# EAGLE design 2nd project (EAGLE 9.6.2)
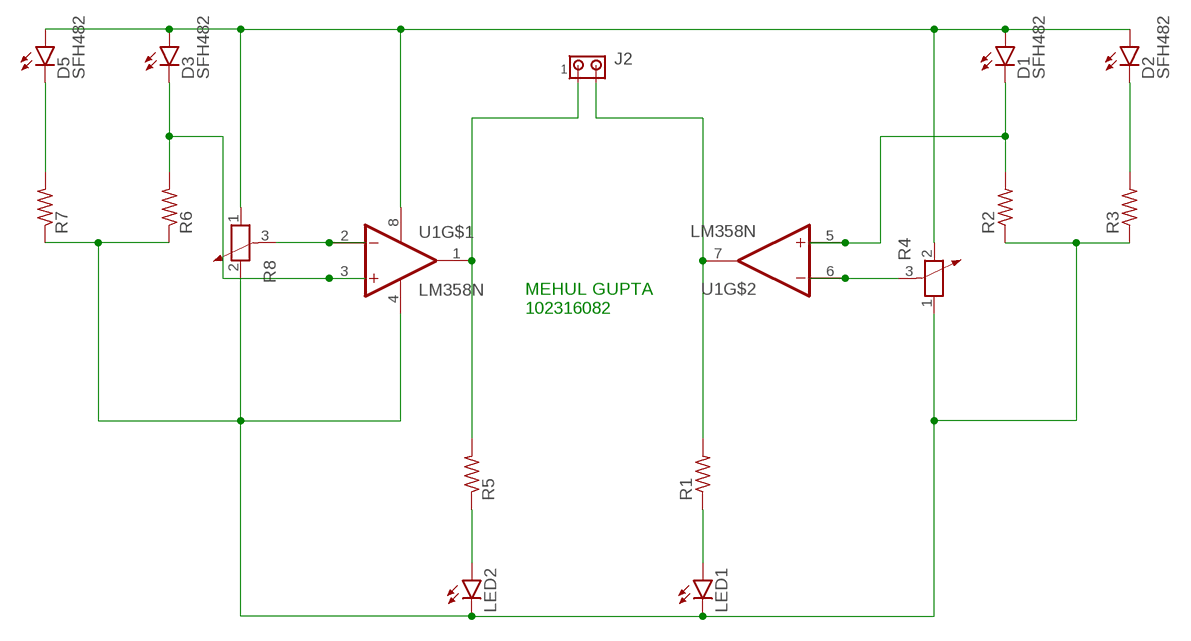
[diagram p0: schematic, sheet 1]

## Parts
D1  SFH482  [SFH482]
D2  SFH482  [SFH482]
D3  SFH482  [SFH482]
D5  SFH482  [SFH482]
J2  MTA02-100  [10X02MTA]
LED1  LED3MM  [LED3MM]
LED2  LED3MM  [LED3MM]
R1  R-US_0204/5  [0204/5]
R2  R-US_0204/5  [0204/5]
R3  R-US_0204/5  [0204/5]
R4  POTENTIOMETER_PT-10  [PT-10]
R5  R-US_0204/5  [0204/5]
R6  R-US_0204/5  [0204/5]
R7  R-US_0204/5  [0204/5]
R8  POTENTIOMETER_PT-10  [PT-10]
U1  LM358N  [DIP762W46P254L960H508Q8]

## Nets
N$1: R4.3 U1.6(2IN-)
N$2: J2.2 R1.2 U1.7(2OUT)
N$3: D3.K(C) R6.2 U1.3(1IN+)
N$4: LED1.A R1.1
N$6: D2.K(C) R3.2
N$7: D1.K(C) R2.2 U1.5(2IN+)
N$8: R8.3 U1.2(1IN-)
N$10: J2.1 R5.2 U1.1(1OUT)
N$11: LED2.A R5.1
N$12: LED1.K(C) LED2.K(C) R2.1 R3.1 R4.1 R6.1 R7.1 R8.2 U1.4(GND)
N$13: D1.A D2.A D3.A D5.A R4.2 R8.1 U1.8(VCC)
N$14: D5.K(C) R7.2

## Notes on the sheet
- MEHUL GUPTA
  102316082

## Library data of the parts
D1-D3 D5 = led:SFH482: IR LED infrared emitting diode, Infineon
J2 = con-amp:MTA02-100: AMP connector
LED1 LED2 = led:LED: LED OSRAM: - CHIPLED LG R971, LG N971, LY N971, LG Q971, LY Q971, LO R971, LY R971 LH N974, LH R974 LS Q976, LO Q976, LY Q976 LO Q996 - Hyper CHIPLED LW Q18S LB Q993, LB Q99A, LB R99A - SideLED LS A670, LO A670, LY A670, LG A670, LP A670 LB A673, LV A673, LT A673, LW A673 LH A674 LY A675 LS A676, LA A676, LO A676, LY A676, LW A676 LS A679, LY A679, LG A679 - Hyper Micro SIDELED® LS Y876, LA Y876, LO Y876, LY Y876 LT Y87S - SmartLED LW L88C, LW L88S LB L89C, LB L89S, LG L890 LS L89K, LO L89K, LY L89K LS L896, LA L896, LO L896, LY L896 - TOPLED LS T670, LO T670, LY T670, LG T670, LP T670 LSG T670, LSP T670, LSY T670, LOP T670, LYG T670 LG T671, LOG T671, LSG T671 LB T673, LV T673, LT T673, LW T673 LH T674 LS T676, LA T676, LO T676, LY T676, LB T676, LH T676, LSB T676, LW T676 LB T67C, LV T67C, LT T67C, LS T67K, LO T67K, LY T67K, LW E67C LS E67B, LA E67B, LO E67B, LY E67B, LB E67C, LV E67C, LT E67C LW T67C LS T679, LY T679, LG T679 LS T770, LO T770, LY T770, LG T770, LP T770 LB T773, LV T773, LT T773, LW T773 LH T774 LS E675, LA E675, LY E675, LS T675 LS T776, LA T776, LO T776, LY T776, LB T776 LHGB T686 LT T68C, LB T68C - Hyper Mini TOPLED® LB M676 - Mini TOPLED Santana® LG M470 LS M47K, LO M47K, LY M47K Source: http://www.osram.convergy.de LUXEON: - LUMILED® LXK2-PW12-R00, LXK2-PW12-S00, LXK2-PW14-U00, LXK2-PW14-V00 LXK2-PM12-R00, LXK2-PM12-S00, LXK2-PM14-U00 LXK2-PE12-Q00, LXK2-PE12-R00, LXK2-PE12-S00, LXK2-PE14-T00, LXK2-PE14-U00 LXK2-PB12-K00, LXK2-PB12-L00, LXK2-PB12-M00, LXK2-PB14-N00, LXK2-PB14-P00, LXK2-PB14-Q00 LXK2-PR12-L00, LXK2-PR12-M00, LXK2-PR14-Q00, LXK2-PR14-R00 LXK2-PD12-Q00, LXK2-PD12-R00, LXK2-PD12-S00 LXK2-PH12-R00, LXK2-PH12-S00 LXK2-PL12-P00, LXK2-PL12-Q00, LXK2-PL12-R00 Source: www.luxeon.com KINGBRIGHT: KA-3528ASYC Source: www.kingbright.com
R1-R3 R5-R7 = rcl:R-US_: RESISTOR, American symbol; SPICEPREFIX: R
R4 R8 = rcl:POTENTIOMETER_: Potentiometer; SPICEMODEL: POT; SPICEPREFIX: X
U1 = LM358N:LM358N: IC OPAMP GP 2 CIRCUIT 8DIP Check availability <https://pricing.snapeda.com/parts/LM358N/Harris%20Corporation/view-part?ref=eda>; AVAILABILITY: Not in stock; CHECK_PRICES: https://www.snapeda.com/parts/LM358N/Harris/view-part/?ref=eda; DESCRIPTION: General Purpose Amplifier 2 Circuit 8-PDIP; MF: Harris Corporation; MP: LM358N; PACKAGE: None; PRICE: None; SNAPEDA_LINK: https://www.snapeda.com/parts/LM358N/Harris/view-part/?ref=snap

## Board
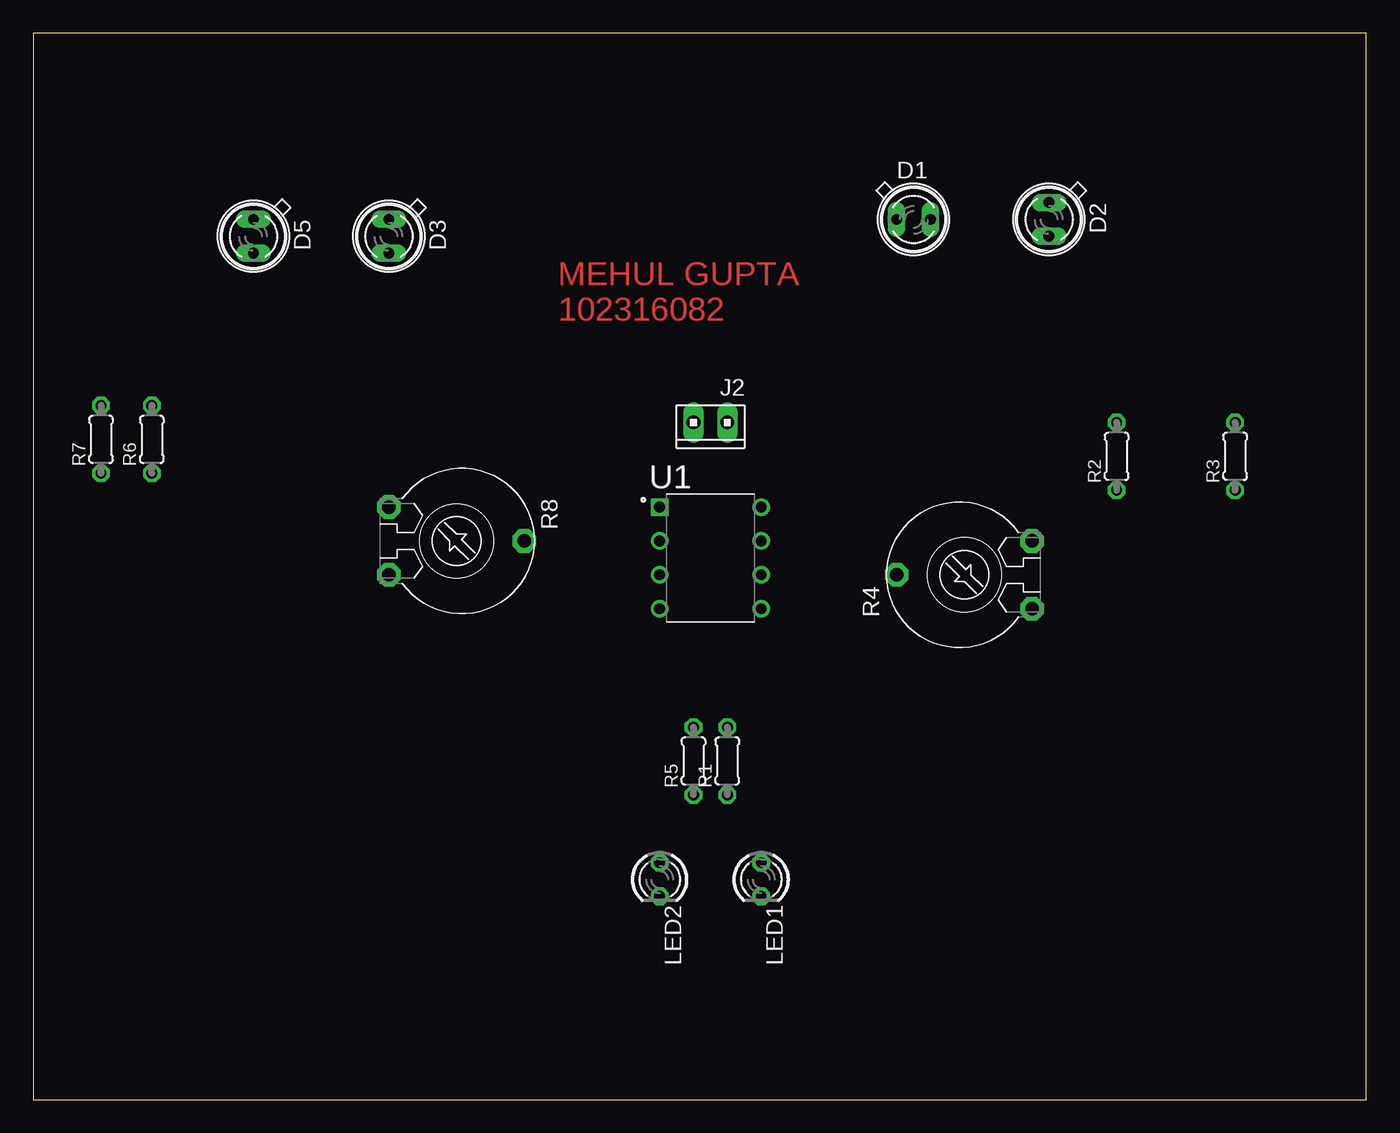
[diagram p1: board, top side]
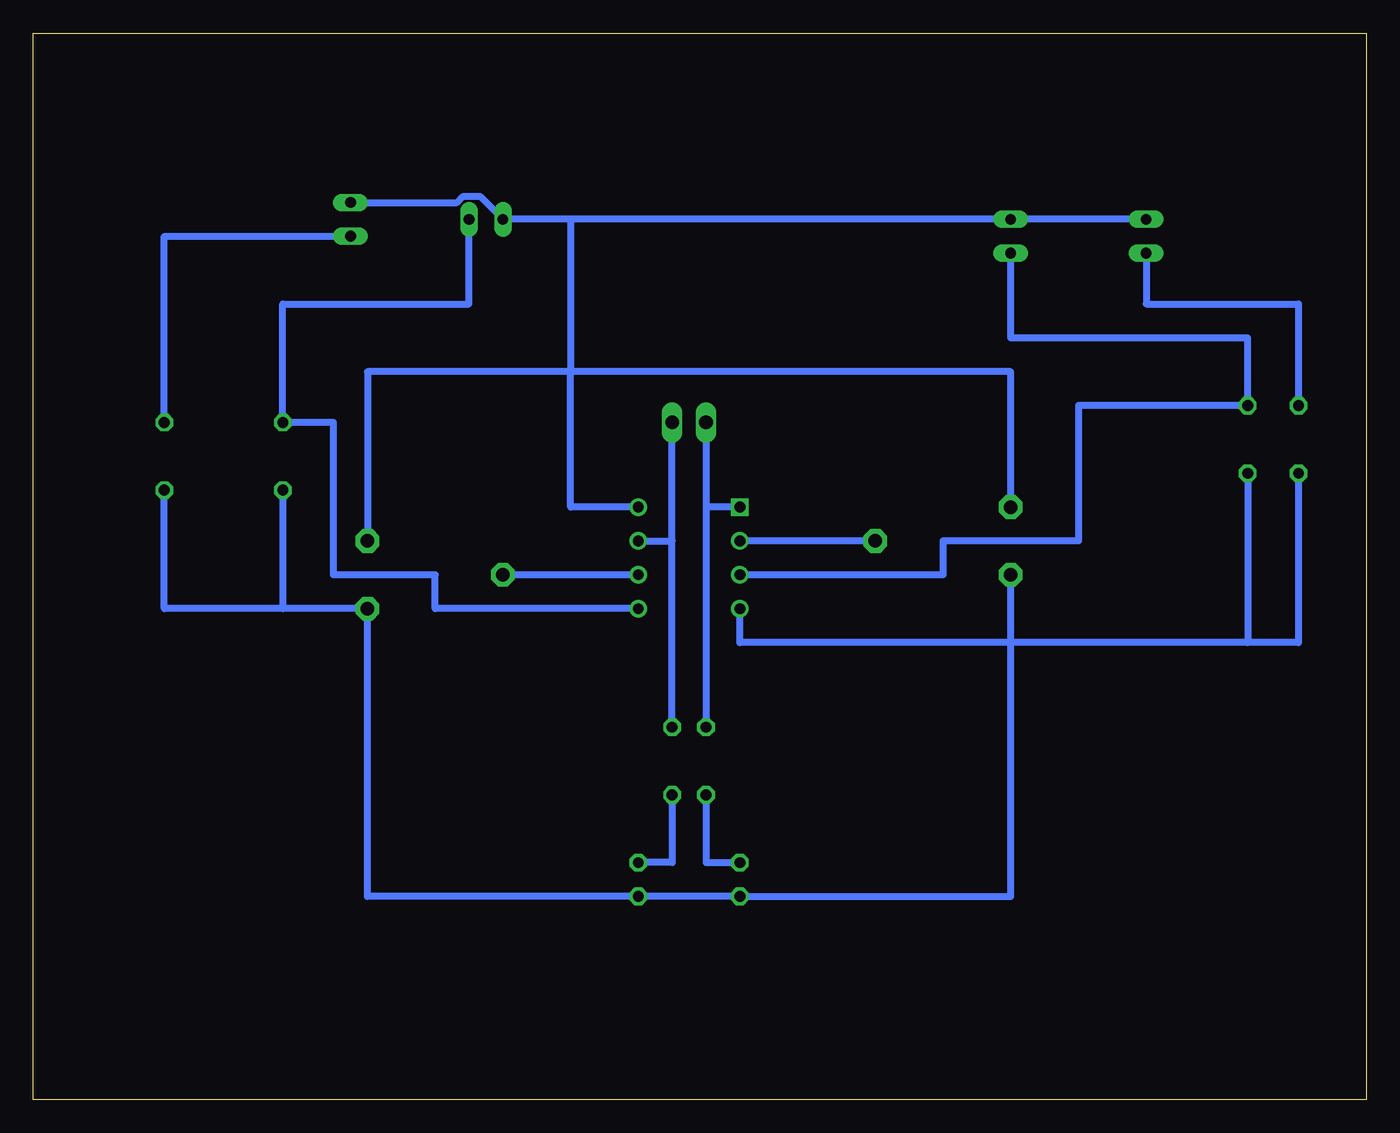
[diagram p2: board, bottom side, seen from below]

Size 100 x 80 mm. Coordinates in mm from the lower left corner, seen from the top.
Outline: 0,0 100,0 100,80 0,80 0,0
Copper layers (1*16): Top 0.035mm / dielectric 1.5mm / Bottom 0.035mm
Design rules "default": minimum track width 6mil, minimum drill 0.35mm, track to track 6mil, track to pad 6mil, pad to pad 6mil, via to via 6mil, smd to smd 6mil, copper to edge 40mil, drill to drill 6mil, minimum pad ring 10mil, minimum via ring 8mil, stop-mask expansion 4mil, vias tented up to drill 0mil, thermal gap 10mil

### Footprints (pad centres in the part's own frame; a part is rotated, then mirrored left to right if it is on the bottom)
SFH482 = drill 0.813 long: A -1.27,0; K 1.27,0
10X02MTA = drill 1.016 long: 1 1.27,0; 2 -1.27,0
LED3MM = drill 0.813 octagon: A -1.27,0; K 1.27,0
0204/5 = drill 0.813 octagon: 1 -2.54,0; 2 2.54,0
PT-10 = drill 1.016 pad 1.778 octagon: 1 -2.54,-5.08; 2 2.54,-5.08; 3 0,5.08
DIP762W46P254L960H508Q8 = drill 0.81 pad 1.22 square: 1 -3.81,3.81 | drill 0.81 pad 1.22: 2 -3.81,1.27; 3 -3.81,-1.27; 4 -3.81,-3.81; 5 3.81,-3.81; 6 3.81,-1.27; 7 3.81,1.27; 8 3.81,3.81

### Placement (x,y rotation side)
D1  66.04,66.04 0 top
D2  76.2,66.04 270 top
D3  26.67,64.77 270 top
D5  16.51,64.77 270 top
J2  50.8,50.8 180 top
LED1  54.61,16.51 270 top
LED2  46.99,16.51 270 top
R1  52.07,25.4 90 top
R2  81.28,48.26 90 top
R3  90.17,48.26 90 top
R4  69.85,39.37 90 top
R5  49.53,25.4 90 top
R6  8.89,49.53 90 top
R7  5.08,49.53 90 top
R8  31.75,41.91 270 top
U1  50.8,40.64 0 top

### Tracks (layer width: path | path; a pad name or v marks a point on that pad's centre or on a via)
N$1
  Bottom 0.508: U1.6 R4.3
N$2
  Bottom 0.508: R1.2 52.07,41.91 | 52.07,41.91 J2.2 | U1.7 52.07,41.91
N$3
  Bottom 0.508: U1.3 31.75,39.37 31.75,41.91 21.59,41.91 21.59,52.07 R6.2 8.89,57.15 26.67,57.15 D3.K
N$4
  Bottom 0.508: R1.1 52.07,17.78 LED1.A
N$6
  Bottom 0.508: R3.2 90.17,64.77 D2.K
N$7
  Bottom 0.508: U1.5 69.85,36.83 69.85,39.37 77.47,39.37 77.47,50.8 R2.2 81.28,59.69 67.31,59.69 D1.K
N$8
  Bottom 0.508: R8.3 U1.2
N$10
  Bottom 0.508: J2.1 49.53,44.45 | 49.53,44.45 R5.2 | U1.1 49.53,44.45
N$11
  Bottom 0.508: R5.1 49.53,17.78 LED2.A
N$12
  Bottom 0.508: 26.67,34.29 26.67,15.24 LED2.K LED1.K 74.93,15.24 R4.1 81.28,36.83 | 81.28,36.83 90.17,36.83 R3.1 | R2.1 81.28,36.83 | R7.1 5.08,34.29 8.89,34.29 | 8.89,34.29 26.67,34.29 | 26.67,34.29 46.99,34.29 U1.4 | R6.1 8.89,34.29 | 26.67,34.29 R8.2
N$13
  Bottom 0.508: D5.A D3.A 59.69,66.04 | R8.1 26.67,54.61 59.69,54.61 | 59.69,66.04 D1.A 66.5,67.77 67.75,67.77 68.21,67.31 D2.A | 59.69,66.04 59.69,54.61 | U1.8 59.69,44.45 59.69,54.61 | 59.69,54.61 74.93,54.61 R4.2
N$14
  Bottom 0.508: R7.2 5.08,59.69 16.51,59.69 D5.K

### Text on the board
Top: MEHUL GUPTA / 102316082